# Altium project LM1117_Regulator.PrjPcb
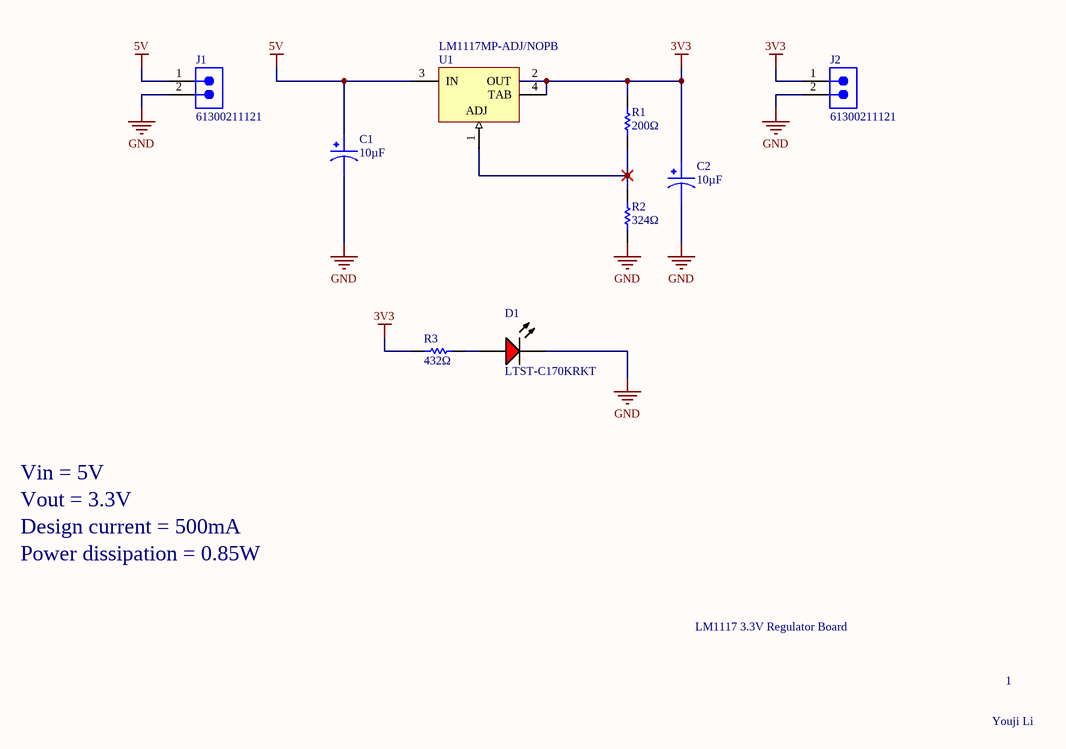
[diagram p0: Sheet1.SchDoc]
1 sheet, 9 parts. Net scope: global (net labels, ports and power ports of the same name join across sheets).
Board file: PCB2.PcbDoc

## Sheet Sheet1.SchDoc: LM1117 3.3V Regulator Board
size A; DrawnBy: Youji Li; Revision: 1; SheetNumber: 1; SheetTotal: 1

### Parts
C1  10µF  [CAPPM2012X120]
C2  10µF  [CAPPM2012X120]
D1  LTST-C170KRKT  [LTST-C170KRKT_V]
J1  61300211121  [61300211121]
J2  61300211121  [61300211121]
R1  value 200Ω  [RESC2013X60X30ML20T20]  (hidden comment: RK73H2ATTD2000F)
R2  value 324Ω  [RESC2013X60X30ML20T20]  (hidden comment: RK73H2ATTD3240F)
R3  value 432Ω  [RESC2013X60X30ML20T20]  (hidden comment: RK73H2ATTD4320F)
U1  LM1117MP-ADJ/NOPB  [DCY0004A_M]

### Nets
3V3: C2.P(POS) J2.1 R1.2 R3.2 U1.2(OUT) U1.4(TAB)
5V: C1.P(POS) J1.1 U1.3(IN)
GND: C1.N(NEG) C2.N(NEG) D1.2(K) J1.2 J2.2 R2.1
NetD1_1: D1.1(A) R3.1
NetR1_1: R1.1 R2.2 U1.1(ADJ)

### Notes on the sheet
- Vin = 5V
- Vout = 3.3V
- Design current = 500mA
- Power dissipation = 0.85W
- LM1117 3.3V Regulator Board
- 1
- Youji Li

### Library data of the parts
C1 C2 = F921A106MPA: <a href="https://pricing.snapeda.com/parts/F921A475MPA/AVX/view-part?ref=eda">Check availability</a> <a href="https://pricing.snapeda.com/parts/F921A475MPA/AVX/view-part?ref=eda">Check availability</a> <a href="https://pricing.snapeda.com/parts/F921A475MPA/AVX/view-part?ref=eda">Check availability</a>; Manufacturer: Kyocera AVX; Value: 10uF; ESR: 6R; Voltage Rating: 10V; Tolerance: 20%; Manufacturer Part Number: F921A106MPA; Package: None; Supplier Part Number: 478-11412-1-ND
D1 = CMP-00026-00003-1: Lite-On RedLED, CHIP LED 0805series, 2012 (0805)encapsulation, wavelength631 nm, 2 x 1.25mm; Manufacturer: Lite-On Inc.; Color: Red; Forward Voltage: 2.4V; Case/Package: 0805
J1 J2 = CMP-002-00071-1: WR-PHD Straight Male, PCB Header, Through Hole, 1 Rows, 2 Contacts, 2.54mm Pitch; Number of Positions: 2; Current Rating: 3A; Mounting Technology: Through Hole; Pitch: 2.54mm
R1 = CMP-009-00178-1: Res Thick Film 0805 200 Ohm 1% 0.25W(1/4W) ±100ppm/C Pad SMD Automotive T/R; Power Rating: 250mW; Tolerance: 1%; Case/Package: 0805
R2 = CMP-009-00177-1: Res Thick Film 0805 324 Ohm 1% 0.25W(1/4W) ±100ppm/C Pad SMD Automotive T/R; Power Rating: 250mW; Tolerance: 1%; Case/Package: 0805
R3 = CMP-009-00179-1: Res Thick Film 0805 432 Ohm 1% 0.25W(1/4W) ±100ppm/C Pad SMD T/R Automotive AEC-Q200; Power Rating: 250mW; Case/Package: 0805; Tolerance: 1%
U1 = CMP-019-00051-1: LDO Regulator Pos 1.25V to 13.8V 0.8A 4-Pin(3+Tab) SOT-223 T/R; Dropout Voltage: 1.2V; Output Current: 800mA; Max Supply Voltage: 15V; Output Voltage: 13.8V; Case/Package: SOT-223